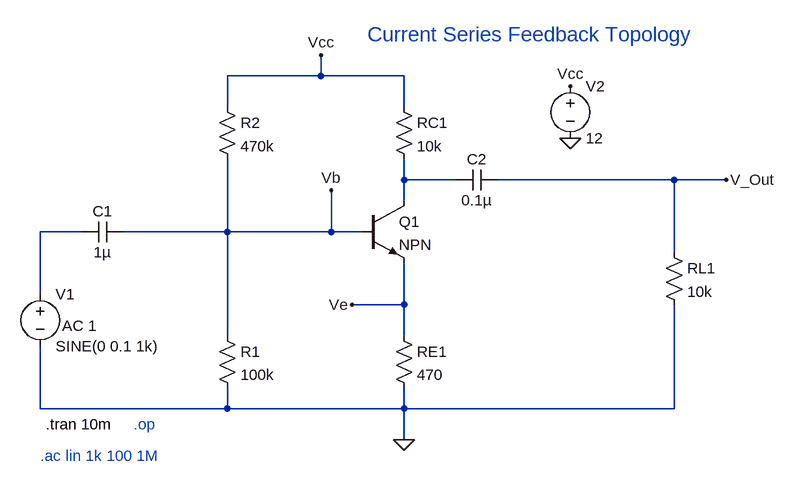
[diagram p0: schematic Current_Series_Feedback.asc]
Current_Series_Feedback.asc, the LTspice schematic file:
Version 4.1
SHEET 1 880 680
WIRE 0 -48 0 -80
WIRE 0 -48 -144 -48
WIRE 128 -48 0 -48
WIRE -144 0 -144 -48
WIRE 128 0 128 -48
WIRE 128 112 128 80
WIRE 208 112 128 112
WIRE 544 112 272 112
WIRE 624 112 544 112
WIRE 128 144 128 112
WIRE -368 192 -432 192
WIRE -144 192 -144 80
WIRE -144 192 -304 192
WIRE 16 192 16 128
WIRE 16 192 -144 192
WIRE 64 192 16 192
WIRE 544 224 544 112
WIRE -432 288 -432 192
WIRE 128 304 128 240
WIRE 128 304 48 304
WIRE -144 352 -144 192
WIRE 128 352 128 304
WIRE -432 464 -432 368
WIRE -144 464 -144 432
WIRE -144 464 -432 464
WIRE 128 464 128 432
WIRE 128 464 -144 464
WIRE 544 464 544 304
WIRE 544 464 128 464
WIRE 128 512 128 464
FLAG 128 512 0
FLAG 384 48 0
FLAG 384 -32 Vcc
FLAG 0 -80 Vcc
FLAG 624 112 V_Out
FLAG 16 128 Vb
FLAG 48 304 Ve
SYMBOL npn 64 144 R0
SYMATTR InstName Q1
SYMBOL voltage -432 272 R0
WINDOW 123 34 64 Left 2
WINDOW 39 0 0 Left 0
SYMATTR Value2 AC 1
SYMATTR InstName V1
SYMATTR Value SINE(0 0.1 1k)
SYMBOL cap -304 176 R90
WINDOW 0 0 32 VBottom 2
WINDOW 3 32 32 VTop 2
SYMATTR InstName C1
SYMATTR Value 1µ
SYMBOL res 112 336 R0
SYMATTR InstName RE1
SYMATTR Value 470
SYMBOL res -160 336 R0
SYMATTR InstName R1
SYMATTR Value 100k
SYMBOL res -160 -16 R0
SYMATTR InstName R2
SYMATTR Value 470k
SYMBOL res 112 -16 R0
SYMATTR InstName RC1
SYMATTR Value 10k
SYMBOL voltage 384 -48 R0
WINDOW 123 0 0 Left 0
WINDOW 39 0 0 Left 0
SYMATTR InstName V2
SYMATTR Value 12
SYMBOL cap 272 96 R90
WINDOW 0 0 32 VBottom 2
WINDOW 3 32 32 VTop 2
SYMATTR InstName C2
SYMATTR Value 0.1µ
SYMBOL res 528 208 R0
SYMATTR InstName RL1
SYMATTR Value 10k
TEXT -432 536 Left 2 ;.ac lin 1k 100 1M
TEXT -424 488 Left 2 !.tran 10m
TEXT 72 -112 Left 3 ;Current Series Feedback Topology
TEXT -288 488 Left 2 ;.op

The netlist it stands for:
* Current_Series_Feedback.asc
Q1 N001 Vb Ve 0 NPN
V1 N002 0 SINE(0 0.1 1k) AC 1
C1 Vb N002 1µ
RE1 Ve 0 470
R1 Vb 0 100k
R2 Vcc Vb 470k
RC1 Vcc N001 10k
V2 Vcc 0 12
C2 V_Out N001 0.1µ
RL1 V_Out 0 10k
.model NPN NPN
.model PNP PNP
.lib standard.bjt
* .ac lin 1k 100 1M
.tran 10m
* Current Series Feedback Topology
* .op
.backanno
.end